# Altium schematic sheet S7CAS-PLEIADES-CARTE-MERE_P01_DDR3.SchDoc
size Tabloid; DocumentNumber: 8; SheetNumber: 8; SheetTotal: 17; Sheet_Name: DDR3; Size: 11x17
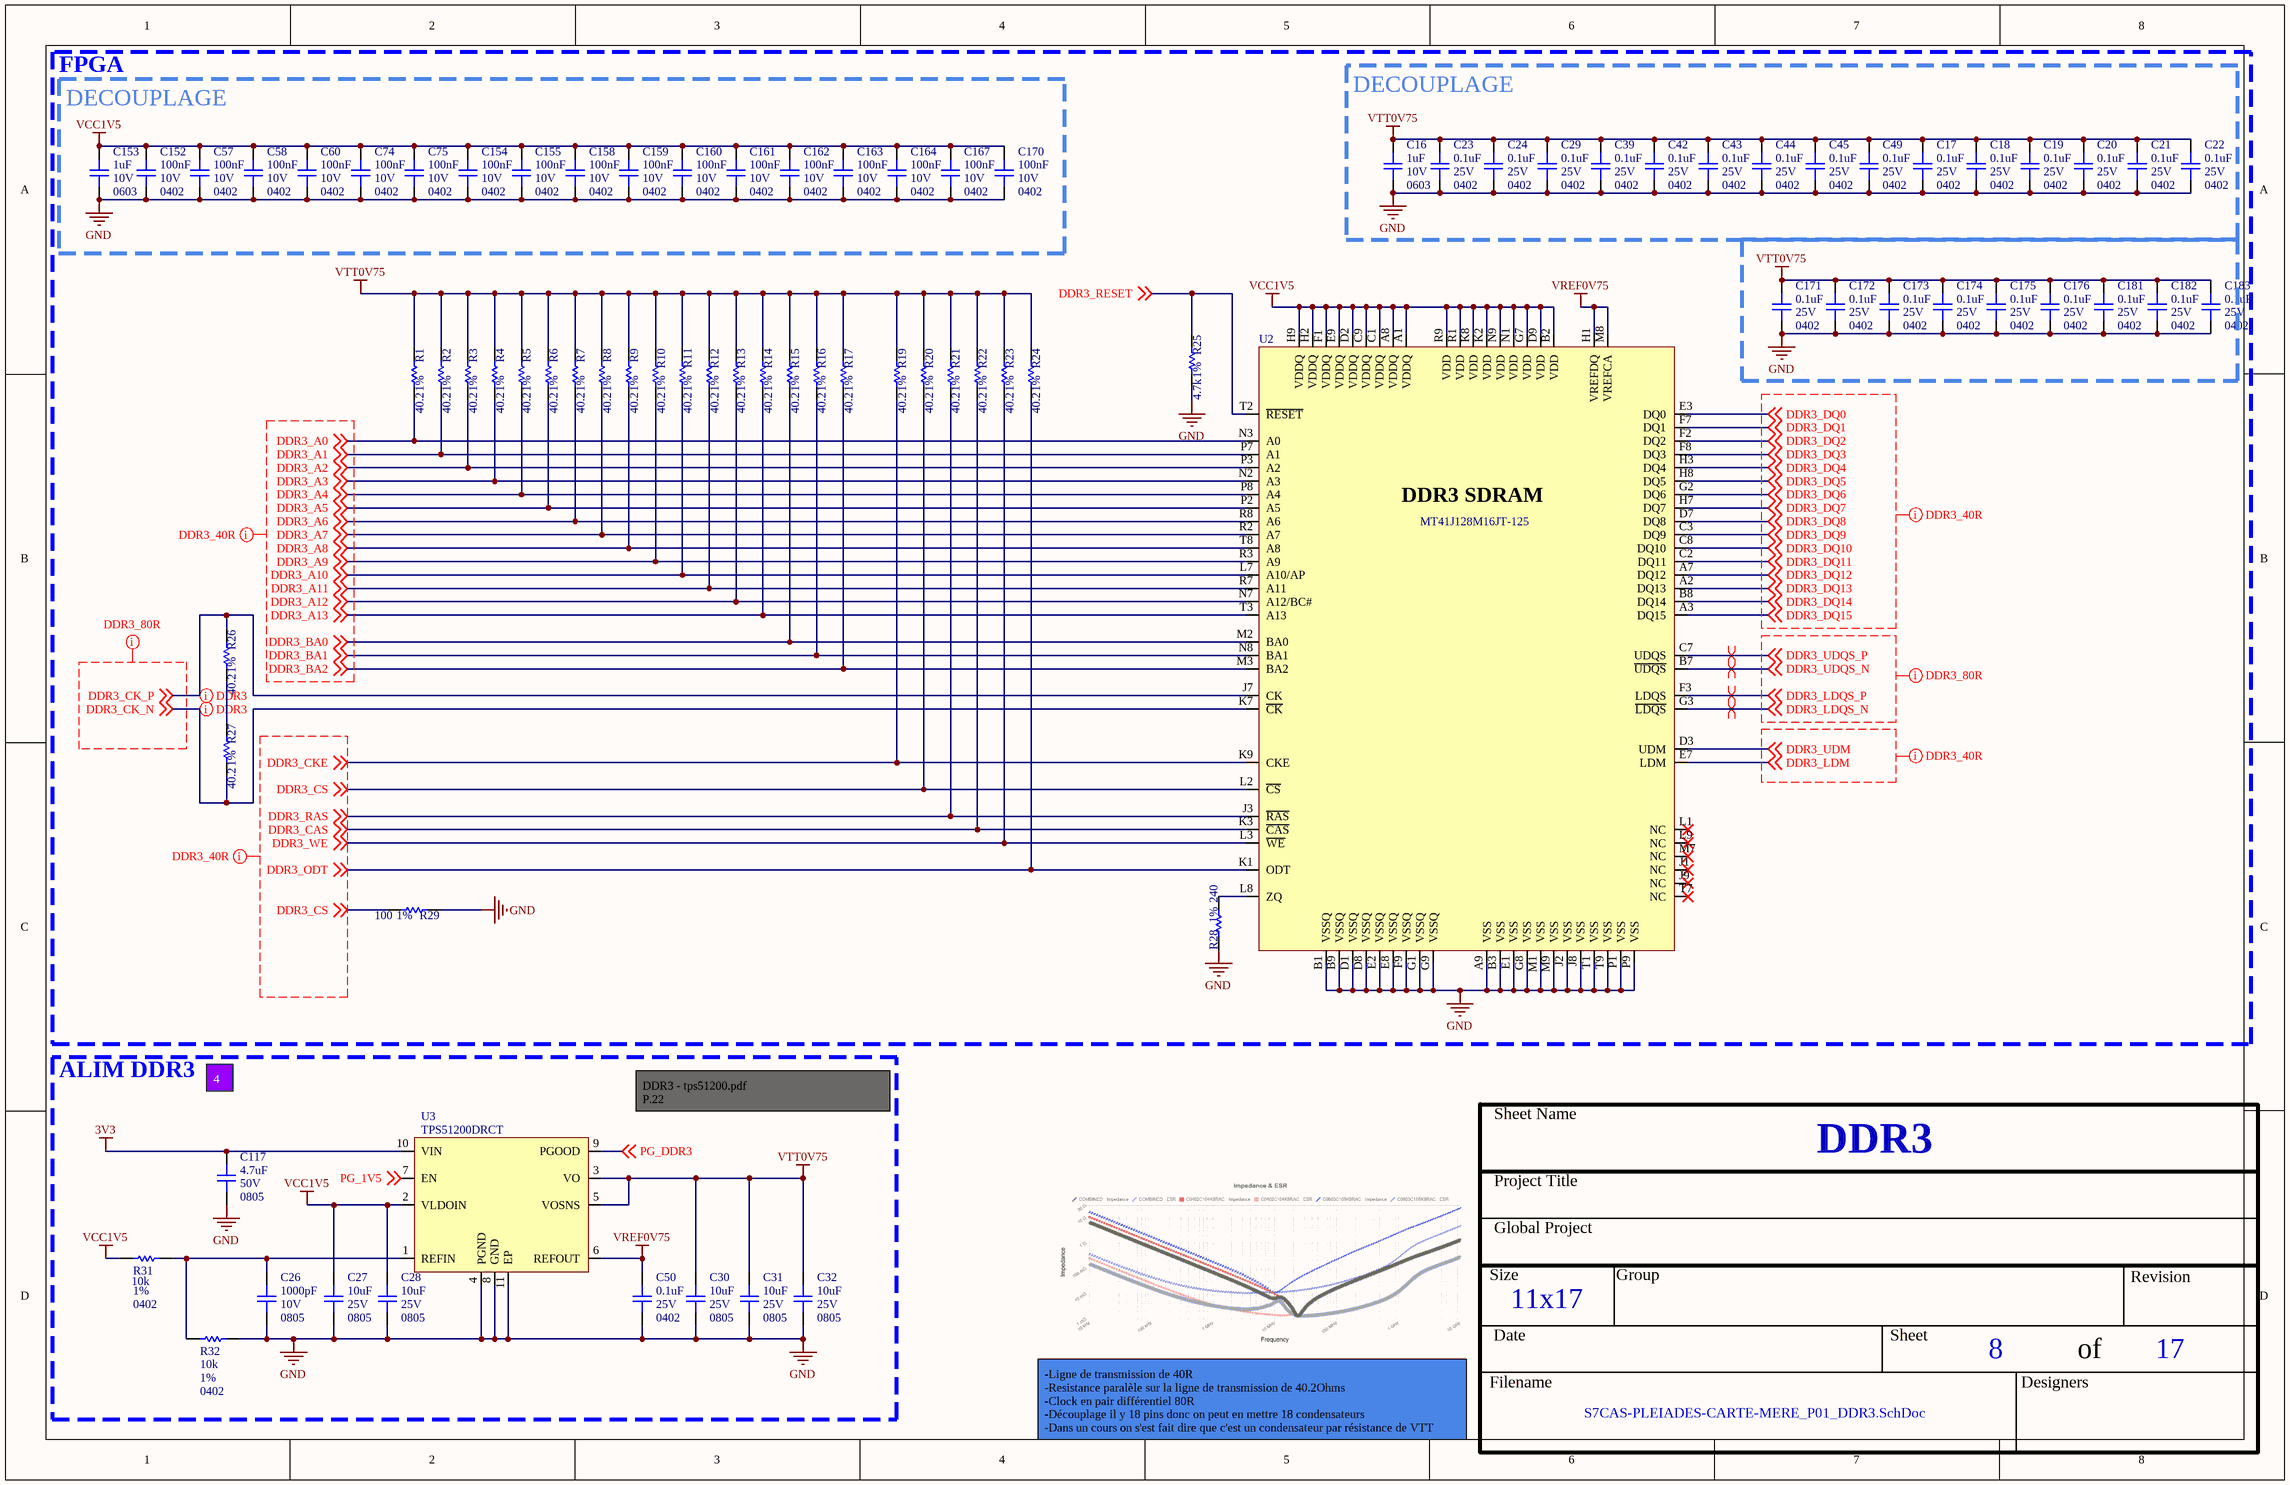
[diagram p0: S7CAS-PLEIADES-CARTE-MERE_P01_DDR3.SchDoc]

## Parts
C16  value 1uF  Voltage: 10V  Package: 0603  [CAP_0603]  (hidden comment: CAP - 0603)
C17  value 0.1uF  Voltage: 25V  Package: 0402  [CAP_0402]  (hidden comment: CAP - 0402)
C18  value 0.1uF  Voltage: 25V  Package: 0402  [CAP_0402]  (hidden comment: CAP - 0402)
C19  value 0.1uF  Voltage: 25V  Package: 0402  [CAP_0402]  (hidden comment: CAP - 0402)
C20  value 0.1uF  Voltage: 25V  Package: 0402  [CAP_0402]  (hidden comment: CAP - 0402)
C21  value 0.1uF  Voltage: 25V  Package: 0402  [CAP_0402]  (hidden comment: CAP - 0402)
C22  value 0.1uF  Voltage: 25V  Package: 0402  [CAP_0402]  (hidden comment: CAP - 0402)
C23  value 0.1uF  Voltage: 25V  Package: 0402  [CAP_0402]  (hidden comment: CAP - 0402)
C24  value 0.1uF  Voltage: 25V  Package: 0402  [CAP_0402]  (hidden comment: CAP - 0402)
C26  value 1000pF  Voltage: 10V  Package: 0805  [CAP_0805]  (hidden comment: CAP - 0805)
C27  value 10uF  Voltage: 25V  Package: 0805  [CAP_0805]  (hidden comment: CAP - 0805)
C28  value 10uF  Voltage: 25V  Package: 0805  [CAP_0805]  (hidden comment: CAP - 0805)
C29  value 0.1uF  Voltage: 25V  Package: 0402  [CAP_0402]  (hidden comment: CAP - 0402)
C30  value 10uF  Voltage: 25V  Package: 0805  [CAP_0805]  (hidden comment: CAP - 0805)
C31  value 10uF  Voltage: 25V  Package: 0805  [CAP_0805]  (hidden comment: CAP - 0805)
C32  value 10uF  Voltage: 25V  Package: 0805  [CAP_0805]  (hidden comment: CAP - 0805)
C39  value 0.1uF  Voltage: 25V  Package: 0402  [CAP_0402]  (hidden comment: CAP - 0402)
C42  value 0.1uF  Voltage: 25V  Package: 0402  [CAP_0402]  (hidden comment: CAP - 0402)
C43  value 0.1uF  Voltage: 25V  Package: 0402  [CAP_0402]  (hidden comment: CAP - 0402)
C44  value 0.1uF  Voltage: 25V  Package: 0402  [CAP_0402]  (hidden comment: CAP - 0402)
C45  value 0.1uF  Voltage: 25V  Package: 0402  [CAP_0402]  (hidden comment: CAP - 0402)
C49  value 0.1uF  Voltage: 25V  Package: 0402  [CAP_0402]  (hidden comment: CAP - 0402)
C50  value 0.1uF  Voltage: 25V  Package: 0402  [CAP_0402]  (hidden comment: CAP - 0402)
C57  value 100nF  Voltage: 10V  Package: 0402  [CAP_0402]  (hidden comment: CAP - 0402)
C58  value 100nF  Voltage: 10V  Package: 0402  [CAP_0402]  (hidden comment: CAP - 0402)
C60  value 100nF  Voltage: 10V  Package: 0402  [CAP_0402]  (hidden comment: CAP - 0402)
C74  value 100nF  Voltage: 10V  Package: 0402  [CAP_0402]  (hidden comment: CAP - 0402)
C75  value 100nF  Voltage: 10V  Package: 0402  [CAP_0402]  (hidden comment: CAP - 0402)
C117  value 4.7uF  Voltage: 50V  Package: 0805  [CAP_0805]  (hidden comment: CAP - 0805)
C152  value 100nF  Voltage: 10V  Package: 0402  [CAP_0402]  (hidden comment: CAP - 0402)
C153  value 1uF  Voltage: 10V  Package: 0603  [CAP_0603]  (hidden comment: CAP - 0603)
C154  value 100nF  Voltage: 10V  Package: 0402  [CAP_0402]  (hidden comment: CAP - 0402)
C155  value 100nF  Voltage: 10V  Package: 0402  [CAP_0402]  (hidden comment: CAP - 0402)
C158  value 100nF  Voltage: 10V  Package: 0402  [CAP_0402]  (hidden comment: CAP - 0402)
C159  value 100nF  Voltage: 10V  Package: 0402  [CAP_0402]  (hidden comment: CAP - 0402)
C160  value 100nF  Voltage: 10V  Package: 0402  [CAP_0402]  (hidden comment: CAP - 0402)
C161  value 100nF  Voltage: 10V  Package: 0402  [CAP_0402]  (hidden comment: CAP - 0402)
C162  value 100nF  Voltage: 10V  Package: 0402  [CAP_0402]  (hidden comment: CAP - 0402)
C163  value 100nF  Voltage: 10V  Package: 0402  [CAP_0402]  (hidden comment: CAP - 0402)
C164  value 100nF  Voltage: 10V  Package: 0402  [CAP_0402]  (hidden comment: CAP - 0402)
C167  value 100nF  Voltage: 10V  Package: 0402  [CAP_0402]  (hidden comment: CAP - 0402)
C170  value 100nF  Voltage: 10V  Package: 0402  [CAP_0402]  (hidden comment: CAP - 0402)
C171  value 0.1uF  Voltage: 25V  Package: 0402  [CAP_0402]  (hidden comment: CAP - 0402)
C172  value 0.1uF  Voltage: 25V  Package: 0402  [CAP_0402]  (hidden comment: CAP - 0402)
C173  value 0.1uF  Voltage: 25V  Package: 0402  [CAP_0402]  (hidden comment: CAP - 0402)
C174  value 0.1uF  Voltage: 25V  Package: 0402  [CAP_0402]  (hidden comment: CAP - 0402)
C175  value 0.1uF  Voltage: 25V  Package: 0402  [CAP_0402]  (hidden comment: CAP - 0402)
C176  value 0.1uF  Voltage: 25V  Package: 0402  [CAP_0402]  (hidden comment: CAP - 0402)
C181  value 0.1uF  Voltage: 25V  Package: 0402  [CAP_0402]  (hidden comment: CAP - 0402)
C182  value 0.1uF  Voltage: 25V  Package: 0402  [CAP_0402]  (hidden comment: CAP - 0402)
C183  value 0.1uF  Voltage: 25V  Package: 0402  [CAP_0402]  (hidden comment: CAP - 0402)
R1  value 40.2  Precision: 1%  [RES_0402]  (hidden comment: RES - 0402)
R2  value 40.2  Precision: 1%  [RES_0402]  (hidden comment: RES - 0402)
R3  value 40.2  Precision: 1%  [RES_0402]  (hidden comment: RES - 0402)
R4  value 40.2  Precision: 1%  [RES_0402]  (hidden comment: RES - 0402)
R5  value 40.2  Precision: 1%  [RES_0402]  (hidden comment: RES - 0402)
R6  value 40.2  Precision: 1%  [RES_0402]  (hidden comment: RES - 0402)
R7  value 40.2  Precision: 1%  [RES_0402]  (hidden comment: RES - 0402)
R8  value 40.2  Precision: 1%  [RES_0402]  (hidden comment: RES - 0402)
R9  value 40.2  Precision: 1%  [RES_0402]  (hidden comment: RES - 0402)
R10  value 40.2  Precision: 1%  [RES_0402]  (hidden comment: RES - 0402)
R11  value 40.2  Precision: 1%  [RES_0402]  (hidden comment: RES - 0402)
R12  value 40.2  Precision: 1%  [RES_0402]  (hidden comment: RES - 0402)
R13  value 40.2  Precision: 1%  [RES_0402]  (hidden comment: RES - 0402)
R14  value 40.2  Precision: 1%  [RES_0402]  (hidden comment: RES - 0402)
R15  value 40.2  Precision: 1%  [RES_0402]  (hidden comment: RES - 0402)
R16  value 40.2  Precision: 1%  [RES_0402]  (hidden comment: RES - 0402)
R17  value 40.2  Precision: 1%  [RES_0402]  (hidden comment: RES - 0402)
R19  value 40.2  Precision: 1%  [RES_0402]  (hidden comment: RES - 0402)
R20  value 40.2  Precision: 1%  [RES_0402]  (hidden comment: RES - 0402)
R21  value 40.2  Precision: 1%  [RES_0402]  (hidden comment: RES - 0402)
R22  value 40.2  Precision: 1%  [RES_0402]  (hidden comment: RES - 0402)
R23  value 40.2  Precision: 1%  [RES_0402]  (hidden comment: RES - 0402)
R24  value 40.2  Precision: 1%  [RES_0402]  (hidden comment: RES - 0402)
R25  value 4.7k  Precision: 1%  [RES_0402]  (hidden comment: RES - 0402)
R26  value 40.2  Precision: 1%  [RES_0402]  (hidden comment: RES - 0402)
R27  value 40.2  Precision: 1%  [RES_0402]  (hidden comment: RES - 0402)
R28  value 240  Precision: 1%  [RES_0402]  (hidden comment: RES - 0402)
R29  value 100  Precision: 1%  [RES_0402]  (hidden comment: RES - 0402)
R31  value 10k  Package: 0402  Precision: 1%  [RES_0402]  (hidden comment: RES - 0402)
R32  value 10k  Package: 0402  Precision: 1%  [RES_0402]  (hidden comment: RES - 0402)
U2  MT41J128M16JT-125  [MEM_DDR3_MT41J128M16JT-125]
U3  TPS51200DRCT  [REG_PMIC_TPS51200DRCT]

## Blocks framed on the sheet
DECOUPLAGE: C16-C24 C29 C39 C42-C45 C49
ALIM DDR3: C26-C28 C30-C32 C50 C117 R31 R32 U3

## Nets
3V3: C117.2 U3.10(VIN)
GND: C16.1 C17.1 C18.1 C19.1 C20.1 C21.1 C22.1 C23.1 C24.1 C26.1 C27.1 C28.1 C29.1 C30.1 C31.1 C32.1 C39.1 C42.1 C43.1 C44.1 C45.1 C49.1 C50.1 C57.1 C58.1 C60.1 C74.1 C75.1 C117.1 C152.1 C153.1 C154.1 C155.1 C158.1 C159.1 C160.1 C161.1 C162.1 C163.1 C164.1 C167.1 C170.1 C171.1 C172.1 C173.1 C174.1 C175.1 C176.1 C181.1 C182.1 C183.1 R25.1 R28.2 R29.2 R32.2 U2.A9(VSS) U2.B1(VSSQ) U2.B3(VSS) U2.B9(VSSQ) U2.D1(VSSQ) U2.D8(VSSQ) U2.E1(VSS) U2.E2(VSSQ) U2.E8(VSSQ) U2.F9(VSSQ) U2.G1(VSSQ) U2.G8(VSS) U2.G9(VSSQ) U2.J2(VSS) U2.J8(VSS) U2.M1(VSS) U2.M9(VSS) U2.P1(VSS) U2.P9(VSS) U2.T1(VSS) U2.T9(VSS) U3.4(PGND) U3.8(GND) U3.11(EP)
VCC1V5: C27.2 C28.2 C57.2 C58.2 C60.2 C74.2 C75.2 C152.2 C153.2 C154.2 C155.2 C158.2 C159.2 C160.2 C161.2 C162.2 C163.2 C164.2 C167.2 C170.2 R31.1 U2.A1(VDDQ) U2.A8(VDDQ) U2.B2(VDD) U2.C1(VDDQ) U2.C9(VDDQ) U2.D2(VDDQ) U2.D9(VDD) U2.E9(VDDQ) U2.F1(VDDQ) U2.G7(VDD) U2.H2(VDDQ) U2.H9(VDDQ) U2.K2(VDD) U2.K8(VDD) U2.N1(VDD) U2.N9(VDD) U2.R1(VDD) U2.R9(VDD) U3.2(VLDOIN)
VREF0V75: C50.2 U2.H1(VREFDQ) U2.M8(VREFCA) U3.6(REFOUT)
VTT0V75: C16.2 C17.2 C18.2 C19.2 C20.2 C21.2 C22.2 C23.2 C24.2 C29.2 C30.2 C31.2 C32.2 C39.2 C42.2 C43.2 C44.2 C45.2 C49.2 C171.2 C172.2 C173.2 C174.2 C175.2 C176.2 C181.2 C182.2 C183.2 R1.2 R2.2 R3.2 R4.2 R5.2 R6.2 R7.2 R8.2 R9.2 R10.2 R11.2 R12.2 R13.2 R14.2 R15.2 R16.2 R17.2 R19.2 R20.2 R21.2 R22.2 R23.2 R24.2 U3.3(VO) U3.5(VOSNS)
DDR3_A0: R1.1 U2.N3(A0) ; off-sheet DDR3_A0
DDR3_A1: R2.1 U2.P7(A1) ; off-sheet DDR3_A1
DDR3_A2: R3.1 U2.P3(A2) ; off-sheet DDR3_A2
DDR3_A3: R4.1 U2.N2(A3) ; off-sheet DDR3_A3
DDR3_A4: R5.1 U2.P8(A4) ; off-sheet DDR3_A4
DDR3_A5: R6.1 U2.P2(A5) ; off-sheet DDR3_A5
DDR3_A6: R7.1 U2.R8(A6) ; off-sheet DDR3_A6
DDR3_A7: R8.1 U2.R2(A7) ; off-sheet DDR3_A7
DDR3_A8: R9.1 U2.T8(A8) ; off-sheet DDR3_A8
DDR3_A9: R10.1 U2.R3(A9) ; off-sheet DDR3_A9
DDR3_A10: R11.1 U2.L7(A10/AP) ; off-sheet DDR3_A10
DDR3_A11: R12.1 U2.R7(A11) ; off-sheet DDR3_A11
DDR3_A12: R13.1 U2.N7(A12/BC#) ; off-sheet DDR3_A12
DDR3_A13: R14.1 U2.T3(A13) ; off-sheet DDR3_A13
DDR3_BA0: R15.1 U2.M2(BA0) ; off-sheet DDR3_BA0
DDR3_BA1: R16.1 U2.N8(BA1) ; off-sheet DDR3_BA1
DDR3_BA2: R17.1 U2.M3(BA2) ; off-sheet DDR3_BA2
DDR3_CAS: R22.1 U2.K3(~{CAS}) ; off-sheet DDR3_CAS
DDR3_CK_N: R27.1 U2.K7(~{CK}) ; off-sheet DDR3_CK_N
DDR3_CK_P: R26.2 U2.J7(CK) ; off-sheet DDR3_CK_P
DDR3_CKE: R19.1 U2.K9(CKE) ; off-sheet DDR3_CKE
DDR3_CS: R20.1 R29.1 U2.L2(~{CS}) ; off-sheet DDR3_CS
DDR3_DQ0: U2.E3(DQ0) ; off-sheet DDR3_DQ0
DDR3_DQ1: U2.F7(DQ1) ; off-sheet DDR3_DQ1
DDR3_DQ2: U2.F2(DQ2) ; off-sheet DDR3_DQ2
DDR3_DQ3: U2.F8(DQ3) ; off-sheet DDR3_DQ3
DDR3_DQ4: U2.H3(DQ4) ; off-sheet DDR3_DQ4
DDR3_DQ5: U2.H8(DQ5) ; off-sheet DDR3_DQ5
DDR3_DQ6: U2.G2(DQ6) ; off-sheet DDR3_DQ6
DDR3_DQ7: U2.H7(DQ7) ; off-sheet DDR3_DQ7
DDR3_DQ8: U2.D7(DQ8) ; off-sheet DDR3_DQ8
DDR3_DQ9: U2.C3(DQ9) ; off-sheet DDR3_DQ9
DDR3_DQ10: U2.C8(DQ10) ; off-sheet DDR3_DQ10
DDR3_DQ11: U2.C2(DQ11) ; off-sheet DDR3_DQ11
DDR3_DQ12: U2.A7(DQ12) ; off-sheet DDR3_DQ12
DDR3_DQ13: U2.A2(DQ13) ; off-sheet DDR3_DQ13
DDR3_DQ14: U2.B8(DQ14) ; off-sheet DDR3_DQ14
DDR3_DQ15: U2.A3(DQ15) ; off-sheet DDR3_DQ15
DDR3_LDM: U2.E7(LDM) ; off-sheet DDR3_LDM
DDR3_LDQS_N: U2.G3(~{LDQS}) ; off-sheet DDR3_LDQS_N
DDR3_LDQS_P: U2.F3(LDQS) ; off-sheet DDR3_LDQS_P
DDR3_ODT: R24.1 U2.K1(ODT) ; off-sheet DDR3_ODT
DDR3_RAS: R21.1 U2.J3(~{RAS}) ; off-sheet DDR3_RAS
DDR3_RESET: R25.2 U2.T2(~{RESET}) ; off-sheet DDR3_RESET
DDR3_UDM: U2.D3(UDM) ; off-sheet DDR3_UDM
DDR3_UDQS_N: U2.B7(~{UDQS}) ; off-sheet DDR3_UDQS_N
DDR3_UDQS_P: U2.C7(UDQS) ; off-sheet DDR3_UDQS_P
DDR3_WE: R23.1 U2.L3(~{WE}) ; off-sheet DDR3_WE
PG_1V5: U3.7(EN) ; off-sheet PG_1V5
PG_DDR3: U3.9(PGOOD) ; off-sheet PG_DDR3
NetC26_2: C26.2 R31.2 R32.1 U3.1(REFIN)
NetR26_1: R26.1 R27.2
NetR28_1: R28.1 U2.L8(ZQ)

Not connected (* = marked no-connect by the designer): U2 J1(NC)* J9(NC)* L1(NC)* L9(NC)* M7(NC)* T7(NC)*

## Layout directives
differential pair: DDR3_CK_N, DDR3_CK_P, DDR3_LDQS_N, DDR3_LDQS_P, DDR3_UDQS_N, DDR3_UDQS_P
net class DDR3_40R: DDR3_A0, DDR3_A1, DDR3_A2, DDR3_A3, DDR3_A4, DDR3_A5, DDR3_A6, DDR3_A7, DDR3_A8, DDR3_A9, DDR3_A10, DDR3_A11, DDR3_A12, DDR3_A13, DDR3_BA0, DDR3_BA1, DDR3_BA2, DDR3_CAS, DDR3_CKE, DDR3_CS, DDR3_DQ0, DDR3_DQ1, DDR3_DQ2, DDR3_DQ3, DDR3_DQ4, DDR3_DQ5, DDR3_DQ6, DDR3_DQ7, DDR3_DQ8, DDR3_DQ9, DDR3_DQ10, DDR3_DQ11, DDR3_DQ12, DDR3_DQ13, DDR3_DQ14, DDR3_DQ15, DDR3_LDM, DDR3_ODT, DDR3_RAS, DDR3_UDM, DDR3_WE
net class DDR3_80R: DDR3_CK_N, DDR3_CK_P, DDR3_LDQS_N, DDR3_LDQS_P, DDR3_UDQS_N, DDR3_UDQS_P

## Notes on the sheet
- FPGA
- DECOUPLAGE
- 4
- DDR3 - tps51200.pdf
  P.22
- -Ligne de transmission de 40R
  -Resistance paralèle sur la ligne de transmission de 40.2Ohms
  -Clock en pair différentiel 80R
  -Découplage il y 18 pins donc on peut en mettre 18 condensateurs
  -Dans un cours on s'est fait dire que c'est un condensateur par résistance de VTT
- Sheet Name
- Project Title
- Global Project
- Size
- Group
- Revision
- Date
- Sheet
- of
- Filename
- Designers
- (in symbol MEM_DDR3_MT41J128M16JT-125:K TR) DDR3 SDRAM

## Library data of the parts
C16 C153 = CAP - 0603: Mfg Part Number: C0603C105K8RAC; Precision: 10%; Current: *; CreatedBy: Jonathan Bouchard; Power: *
C17-C24 C29 C39 C42-C45 C49 C50 C171-C176 C181-C183 = CAP - 0402: 0.1 µF ±10% 25V Ceramic Capacitor X7R 0402 (1005 Metric); Mfg Part Number: CL05B104KA5NNNC; Mfg: Samsung Electro-Mechanics; Current: *; CreatedBy: Jonathan Bouchard; Power: *; Precision: 10%; Part Number #1: CL05B104KA5NNNC
C26 = CAP - 0805: 1000 pF ±10% 10V Ceramic Capacitor X7R 0805 (2012 Metric); Mfg Part Number: C0805C102K8RACTU; Current: *; CreatedBy: Jonathan Bouchard; Power: *; Precision: 10%; Part Number #1: C0805C102K8RACTU
C27 C28 C30-C32 = CAP - 0805: 10 µF ±10% 25V Ceramic Capacitor X5R 0805 (2012 Metric); Mfg Part Number: CL21A106KAYNNNE; Mfg: Samsung Electro-Mechanics; Current: *; CreatedBy: Jonathan Bouchard; Power: *; Precision: 10%; Part Number #1: CL21A106KAYNNNE
C57 C58 C60 C74 C75 C152 C154 C155 C158-C164 C167 C170 = CAP - 0402: Mfg Part Number: C0402C104K8RAC; Precision: 10%; Current: *; CreatedBy: Jonathan Bouchard; Power: *
C117 = CAP - 0805: 4.7 µF ±10% 50V Ceramic Capacitor X5R 0805 (2012 Metric); Mfg Part Number: GRT21BR61H475KE13L; Mfg: Murata Electronics; Current: *; CreatedBy: Jonathan Bouchard; Power: *; Precision: 10%
R1-R17 R19-R24 R26 R27 = RES - 0402: 40.2 Ohms ±1% 0.1W, 1/10W Chip Resistor 0402 (1005 Metric) Automotive AEC-Q200 Thick Film; Mfg Part Number: CRCW040240R2FKED; Voltage: 75V; Power: 1/16W; Current: *; CreatedBy: Jonathan Bouchard; Package: 0402; Part Number #1: CRCW040240R2FKED
R25 = RES - 0402: 4.7 kOhms ±1% 0.063W, 1/16W Chip Resistor 0402 (1005 Metric) Moisture Resistant Thick Film; Mfg Part Number: RC0402FR-074K7L; Voltage: 75V; Current: *; CreatedBy: Jonathan Bouchard; Power: 1/16W; Package: 0402; Part Number #1: RC0402FR-074K7L
R28 = RES - 0402: 240 Ohms ±1% 0.1W, 1/10W Chip Resistor 0402 (1005 Metric) Automotive AEC-Q200 Thick Film; Mfg Part Number: ERJ-2RKF2400X; Voltage: 50V; Current: *; CreatedBy: Jonathan Bouchard; Power: 1/10W; Package: 0402; Part Number #1: ERJ-2RKF2400X
R29 = RES - 0402: 100 Ohms ±1% 0.1W, 1/10W Chip Resistor 0402 (1005 Metric) Automotive AEC-Q200 Thick Film; Mfg Part Number: RK73H1ETTP1000F; Voltage: 75V; Current: *; CreatedBy: Jonathan Bouchard; Power: 1/10W; Package: 0402; Part Number #1: RK73H1ETTP1000F
R31 R32 = RES - 0402: 10 kOhms ±1% 0.063W, 1/16W Chip Resistor 0402 (1005 Metric) Automotive AEC-Q200 Thick Film; Mfg Part Number: RMCF0402FT10K0; Voltage: 75V; Current: *; CreatedBy: Jonathan Bouchard; Power: 1/16W; Part Number #1: RMCF0402FT10K0
U2 = MEM_DDR3_MT41J128M16JT-125:K TR: MEM - DDR3 SDRAM 2GBIT 800MHZ - TFBGA-96; Voltage: 1.425 V ~ 1.575 V; Mfg: Micrel; Current: *; Power: *; Mfg Part Number: MT41J128M16JT-125; HelpURL: http://www.micron.com/~/media/Documents/Products/Data%20Sheet/DRAM/DDR3/2Gb_DDR3_SDRAM.pdf; CreatedBy: Jonathan Bouchard; Temperature: 0°C ~ 95°C (TC); Value: *; Precision: *; Package: TFBGA-96; Supplier 1: Digikey; Supplier Part Number 1: 557-1611-1-ND; Part Number #1: MT41J128M16JT-125
U3 = REG_PMIC_TPS51200DRCT: REG - DDR TERMINATION/REF REG - 10-VFDFN; Manufacturer #1: Texas Instruments; Value: DDR, DDR2, DDR3(L), DDR4; Voltage Rating: 2.375V ~ 3.5V; Current Rating: Source: 3A~4.5A, Sink: 3.5A~5.5A; GRAMS Lib Spec: 2.8; Magnetic Material: Unknown; Polarized: Yes; Tolerance: *; Power Max: *; HelpURL: http://www.ti.com/lit/ds/symlink/tps51200.pdf; CreatedBy/Date: Joel Lemay 2019-03-19; VerifiedBy: Nicolas V. (2019-05-31); Temperature: -40°C ~ 85°C; Package: 10-VFDFN; Manufacturer #2: *; Part Number #2: *; Part Number #1: TPS51200DRCT; Supplier 1: Digi-Key; Supplier Part Number 1: 296-23830-1-ND; Cryo: UNKNOWN; Mfg Part Number: TPS51200DRCT